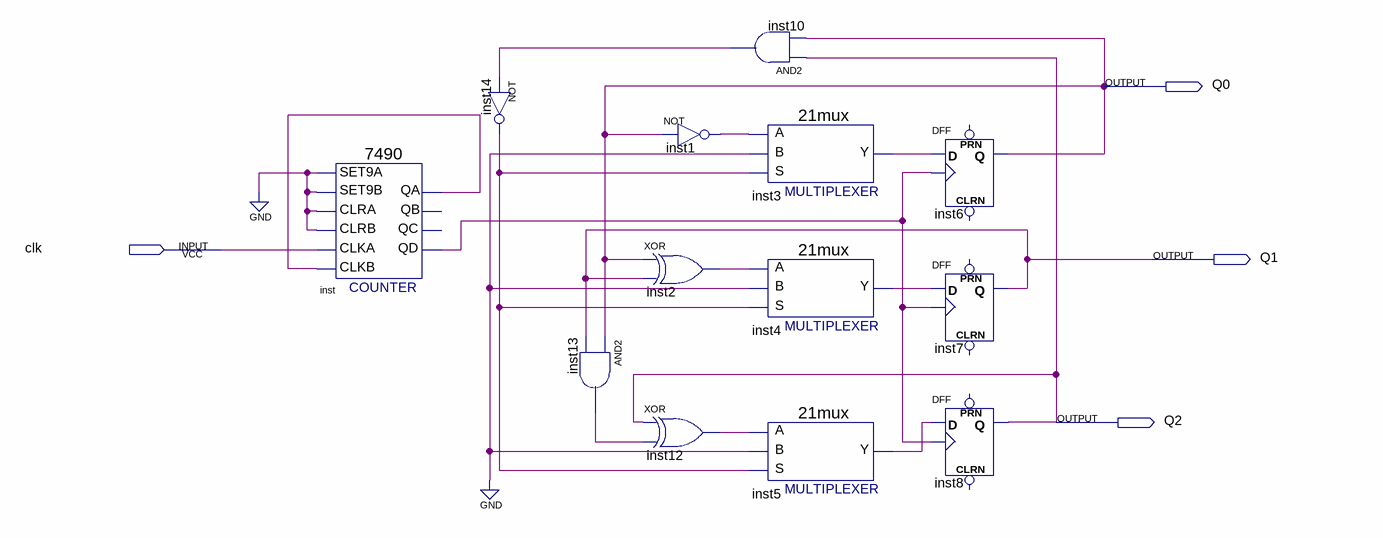
[diagram p0: schematic sheet]
// Quartus schematic HW06.bdf as structural Verilog: 13 symbols, 4 pins
module HW06 (
  input  clk,
  output Q0,
  output Q1,
  output Q2
);

  wire inst1_out, inst2_out, inst3_y, inst4_y, inst5_y, inst10_out, inst12_out, inst13_out, inst14_out,
       inst_qa, inst_qd;

  \7490  inst (
    .SET9A(1'b0), .CLRA(1'b0), .SET9B(1'b0), .CLKB(inst_qa), .CLKA(clk), .CLRB(1'b0), .QD(inst_qd),
    .QA(inst_qa));  // open: QB, QC
  not inst14 (inst14_out, inst10_out);
  and inst13 (inst13_out, Q0, Q1);
  xor inst2 (inst2_out, Q0, Q1);
  xor inst12 (inst12_out, Q2, inst13_out);
  not inst1 (inst1_out, Q0);
  and inst10 (inst10_out, Q2, Q0);
  \21mux  inst3 (.S(inst14_out), .B(1'b0), .A(inst1_out), .Y(inst3_y));
  \21mux  inst4 (.S(inst14_out), .B(1'b0), .A(inst2_out), .Y(inst4_y));
  \21mux  inst5 (.S(inst14_out), .B(1'b0), .A(inst12_out), .Y(inst5_y));
  DFF inst6 (.CLK(inst_qd), .D(inst3_y), .Q(Q0));  // open: CLRN, PRN
  DFF inst7 (.CLK(inst_qd), .D(inst4_y), .Q(Q1));  // open: CLRN, PRN
  DFF inst8 (.CLK(inst_qd), .D(inst5_y), .Q(Q2));  // open: CLRN, PRN
endmodule
